# Altium schematic sheet Power.SchDoc
size Legal
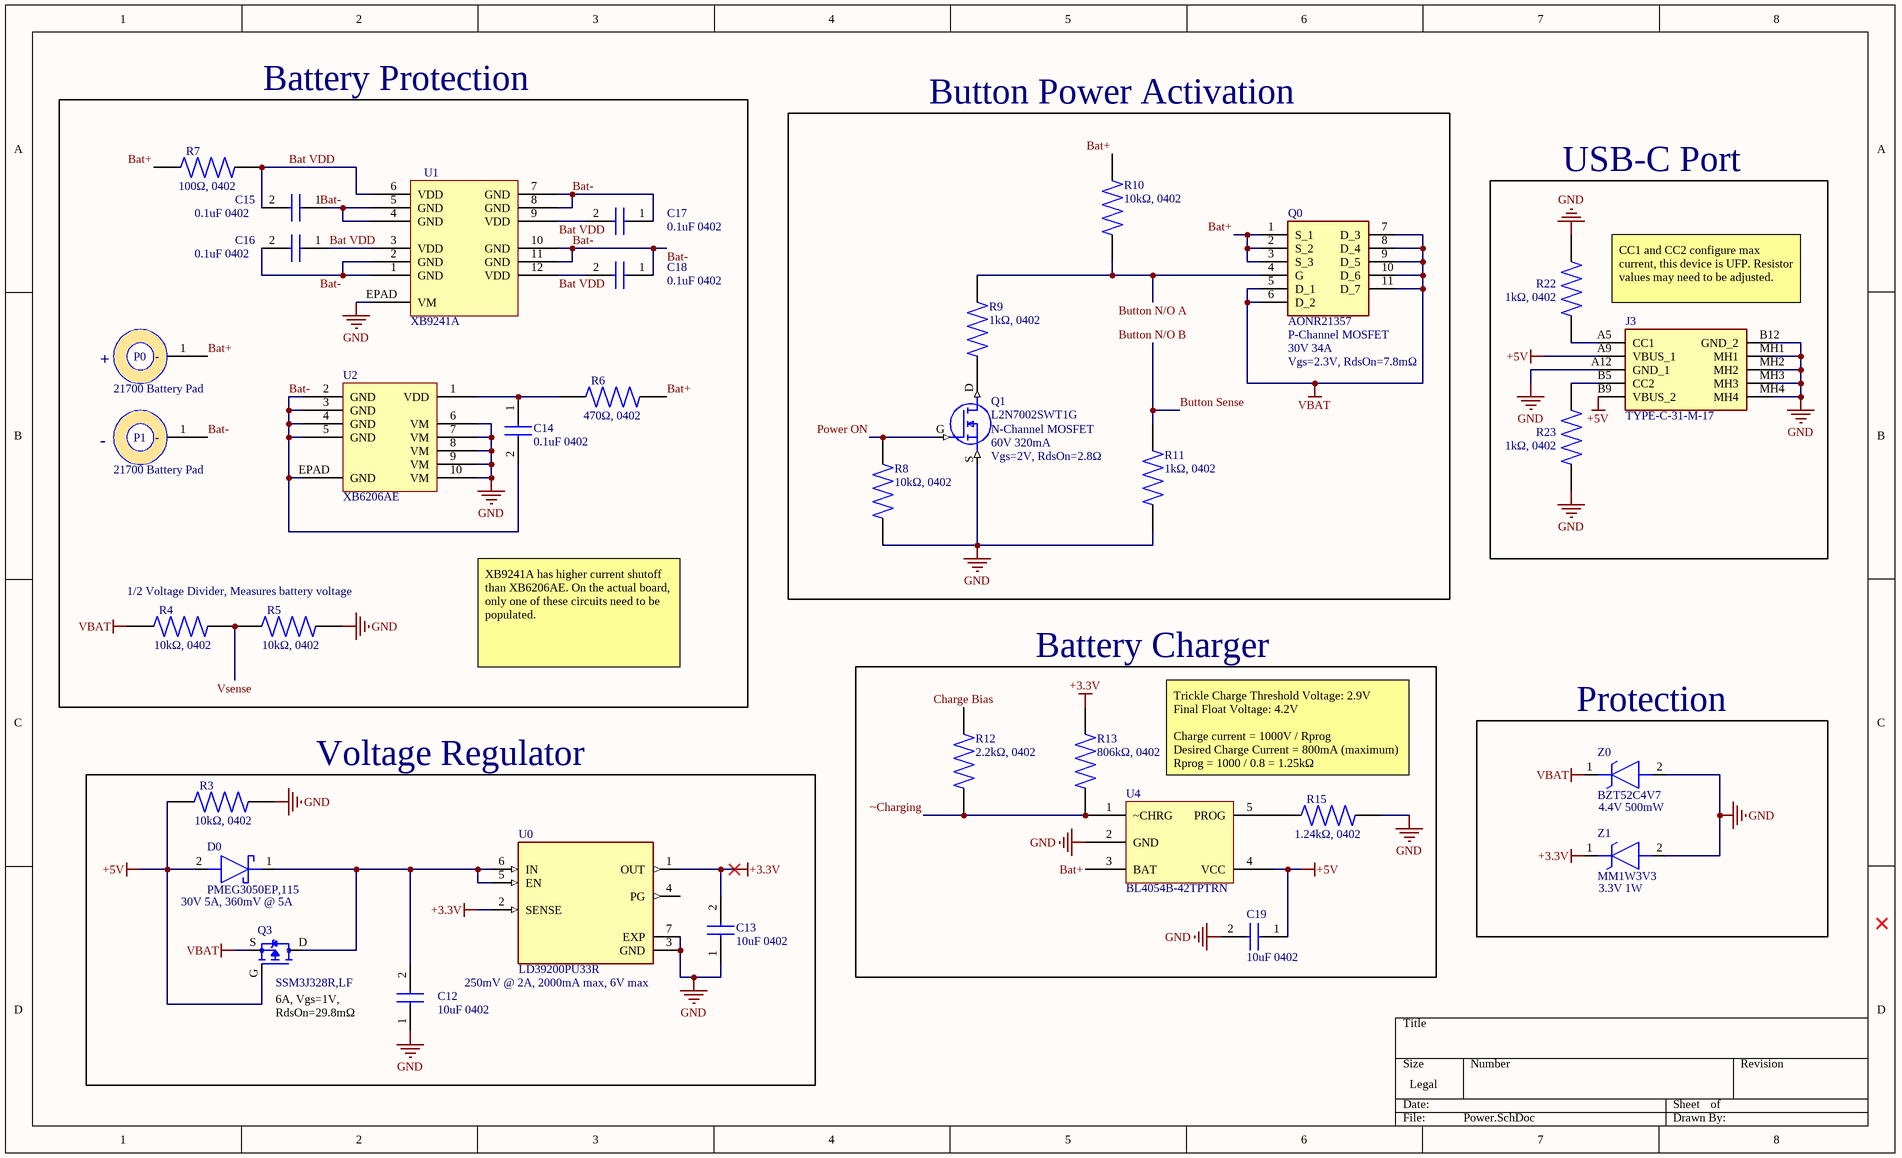
[diagram p0: Power.SchDoc]

## Parts
C12  10uF 0402  [CAPC1005X56N]
C13  10uF 0402  [CAPC1005X56N]
C14  0.1uF 0402  [CAPC1005X56N]
C15  0.1uF 0402  [CAPC1005X56N]
C16  0.1uF 0402  [CAPC1005X56N]
C17  0.1uF 0402  [CAPC1005X56N]
C18  0.1uF 0402  [CAPC1005X56N]
C19  10uF 0402  [CAPC1005X56N]
D0  PMEG3050EP,115  [SOD128]
J3  TYPE-C-31-M-17  [TYPEC31M17]
P0  21700 Battery Pad  [21700 Battery Pad]
P1  21700 Battery Pad  [21700 Battery Pad]
Q0  AONR21357  [AONR21357]
Q1  L2N7002SWT1G  [SC-70]
Q3  SSM3J328R,LF  [SOT-23F]
R3  10kΩ, 0402  [0402]
R4  10kΩ, 0402  [0402]
R5  10kΩ, 0402  [0402]
R6  470Ω, 0402  [0402]
R7  100Ω, 0402  [0402]
R8  10kΩ, 0402  [0402]
R9  1kΩ, 0402  [0402]
R10  10kΩ, 0402  [0402]
R11  1kΩ, 0402  [0402]
R12  2.2kΩ, 0402  [0402]
R13  806kΩ, 0402  [0402]
R15  1.24kΩ, 0402  [0402]
R22  1kΩ, 0402  [0402]
R23  1kΩ, 0402  [0402]
U0  LD39200PU33R  [SON95P300X300X100-7N]
U1  XB9241A  [DFN4x4x0.55-12FC]
U2  XB6206AE  [DFN3X3-10]
U4  BL4054B-42TPTRN  [TSOT23-5]
Z0  BZT52C4V7  [SOD-123]
Z1  MM1W3V3  [SOD-123]

## Blocks framed on the sheet
Battery Protection: C14-C18 P0 P1 R4-R7 U1 U2
Button Power Activation: Q0 Q1 R8-R11
USB-C Port: J3 R22 R23
Battery Charger: C19 R12 R13 R15 U4
Protection: Z0 Z1
Voltage Regulator: C12 C13 D0 Q3 R3 U0

## Nets
+3.3V: C13.2 R13.2 U0.1(OUT) U0.2(SENSE) Z1.1(K)
+5V: C19.1 D0.2(A) J3.A9(VBUS_1) J3.B9(VBUS_2) Q3.G R3.1 U4.4(VCC)
GND: C12.1 C13.1 C19.2 J3.A12(GND_1) J3.B12(GND_2) J3.MH1 J3.MH2 J3.MH3 J3.MH4 Q1.S R3.2 R5.2 R8.1 R11.1 R15.2 R22.2 R23.1 U0.3(GND) U0.7(EXP) U1.EPAD(VM) U2.6(VM) U2.7(VM) U2.8(VM) U2.9(VM) U2.10(VM) U4.2(GND) Z0.2(A) Z1.2(A)
VBAT: Q0.5(D_1) Q0.6(D_2) Q0.7(D_3) Q0.8(D_4) Q0.9(D_5) Q0.10(D_6) Q0.11(D_7) Q3.S R4.1 Z0.1(K)
Bat VDD: C15.2 C16.1 C17.2 C18.2 R7.2 U1.3(VDD) U1.6(VDD) U1.9(VDD) U1.12(VDD)
Bat+: P0.1(-) Q0.1(S_1) Q0.2(S_2) Q0.3(S_3) R6.2 R7.1 R10.2 U4.3(BAT)
Bat-: C14.2 C15.1 C16.2 C17.1 C18.1 P1.1(-) U1.1(GND) U1.2(GND) U1.4(GND) U1.5(GND) U1.7(GND) U1.8(GND) U1.10(GND) U1.11(GND) U2.2(GND) U2.3(GND) U2.4(GND) U2.5(GND) U2.EPAD(GND)
Button N/O A: Q0.4(G) R9.2 R10.1
Button N/O B: R11.2  [also labelled Button Sense]
Charge Bias: R12.2
Power ON: Q1.G R8.2
Vsense: R4.2 R5.1
~Charging: R12.1 R13.1 U4.1(~CHRG)
NetC12_2: C12.2 D0.1(K) Q3.D U0.5(EN) U0.6(IN)
NetC14_1: C14.1 R6.1 U2.1(VDD)
NetJ3_A5: J3.A5(CC1) R22.1
NetJ3_B5: J3.B5(CC2) R23.2
NetQ1_D: Q1.D R9.1
NetR15_1: R15.1 U4.5(PROG)

Not connected (* = marked no-connect by the designer): U0 4(PG)

## Notes on the sheet
- CC1 and CC2 configure max current, this device is UFP. Resistor values may need to be adjusted.
- +
- (near Q0) P-Channel MOSFET
- (near Q0) 30V 34A
- Vgs=2.3V, RdsOn=7.8mΩ
- (near Q1) N-Channel MOSFET
- -
- (near Q1) 60V 320mA
- (near Q1) Vgs=2V, RdsOn=2.8Ω
- 1/2 Voltage Divider, Measures battery voltage
- XB9241A has higher current shutoff than XB6206AE. On the actual board, only one of these circuits need to be populated.
- Trickle Charge Threshold Voltage: 2.9V
  Final Float Voltage: 4.2V
  Charge current = 1000V / Rprog
  Desired Charge Current = 800mA (maximum)
  Rprog = 1000 / 0.8 = 1.25kΩ
- 4.4V 500mW
- 30V 5A, 360mV @ 5A
- (near Z1) 3.3V 1W
- 6A, Vgs=1V,
  RdsOn=29.8mΩ
- (near U0) 250mV @ 2A, 2000mA max, 6V max

## Library data of the parts
C12-C19 = 04025A100BAT2A: Capacitor; Manufacturer_Name: AVX; Datasheet Link: http://www.mouser.com/catalog/supplier/library/pdf/AVXSurfaceMountCeramic.pdf; Height: 0.56mm; Manufacturer_Part_Number: 04025A100BAT2A; Arrow Part Number: 04025A100BAT2A; Arrow Price/Stock: https://www.arrow.com/en/products/04025a100bat2a/avx; Mouser Part Number: 581-04025A100B; Mouser Price/Stock: https://www.mouser.com/Search/Refine.aspx?Keyword=581-04025A100B
D0 = PMEG3050EP,115: Schottky Diode; Manufacturer_Name: Nexperia; Datasheet Link: https://docs-emea.rs-online.com/webdocs/14cd/0900766b814cd012.pdf; Height: 1mm; Manufacturer_Part_Number: PMEG3050EP,115; Arrow Part Number: PMEG3050EP,115; Arrow Price/Stock: https://www.arrow.com/en/products/pmeg3050ep115/nexperia; Mouser Part Number: 771-PMEG3050EP115; Mouser Price/Stock: https://www.mouser.co.uk/ProductDetail/Nexperia/PMEG3050EP115?qs=GcY6OjH1zdmnjQ%2FhUT5aOA%3D%3D
J3 = TYPE-C-31-M-17: Connector; Manufacturer_Name: Korean Hroparts Elec; Datasheet Link: https://datasheet.lcsc.com/szlcsc/1903211732_Korean-Hroparts-Elec-TYPE-C-31-M-17_C283540.pdf; Height: 3.26mm; Manufacturer_Part_Number: TYPE-C-31-M-17
Q0 = AONR21357: MOSFET (P-Channel); Manufacturer_Name: Alpha & Omega Semiconductors; Datasheet Link: https://datasheet.lcsc.com/szlcsc/1910101232_Alpha-Omega-Semicon-AOS-AONR21357_C431196.pdf; Height: 0.9mm; Manufacturer_Part_Number: AONR21357
Q1 = L2N7002SWT1G: MOSFET (N-Channel); pin to pad: D>3 G>1 S>2; Manufacturer_Name: ON Semiconductor; Manufacturer_Part_Number: 2N7000; Datasheet Link: http://www.onsemi.com/pub/Collateral/NDS7002A-D.PDF; Mouser Part Number: 512-2N7000; Mouser Price/Stock: https://www.mouser.co.uk/ProductDetail/ON-Semiconductor/2N7000?qs=FOlmdCx%252BAA2o%2FKZOTk%2F3hg%3D%3D; Arrow Part Number: 2N7000; Arrow Price/Stock: https://www.arrow.com/en/products/2n7000/on-semiconductor
Q3 = SSM3J328R,LF: P-Channel 20V 9.4A (Ta) 2.4W (Ta) Surface Mount 6-MicroFET (2x2); pin to pad: D>3 G>1 S>2; MP: FDMA910PZ; MF: {'manufacturer': u'ON Semiconductor'}; Package: None; Availability: Unavailable; Value: *; Price: None
R3-R13 R15 R22 R23 = Resistor, 0402
U0 = LD39200PU33R: Linear Voltage Regulator IC 1 Output 2A 6-DFN (3x3); MF: {'manufacturer': u'STMicroelectronics'}; Availability: Unavailable; MP: LD39200PU33R; Package: None; Price: None; Value: *
Z0 = BZT52C4V7: Zener Diode; Manufacturer_Name: Nexperia; Manufacturer_Part_Number: BZT52-B5V1J; Datasheet Link: https://assets.nexperia.com/documents/data-sheet/BZT52-B_SER.pdf; Height: 1.3mm; Mouser Part Number: 771-BZT52-B5V1J; Mouser Price/Stock: https://www.mouser.co.uk/ProductDetail/Nexperia/BZT52-B5V1J/?qs=W0yvOO0ixfGU2vzMfcQu3g%3D%3D; Arrow Part Number: BZT52-B5V1J; Arrow Price/Stock: https://www.arrow.com/en/products/bzt52-b5v1j/nexperia
Z1 = MM1W3V3: Zener Diode; Manufacturer_Name: Nexperia; Manufacturer_Part_Number: BZT52-B5V1J; Datasheet Link: https://assets.nexperia.com/documents/data-sheet/BZT52-B_SER.pdf; Height: 1.3mm; Mouser Part Number: 771-BZT52-B5V1J; Mouser Price/Stock: https://www.mouser.co.uk/ProductDetail/Nexperia/BZT52-B5V1J/?qs=W0yvOO0ixfGU2vzMfcQu3g%3D%3D; Arrow Part Number: BZT52-B5V1J; Arrow Price/Stock: https://www.arrow.com/en/products/bzt52-b5v1j/nexperia